# Altium project Cape.PrjPcb (part 2 of 3)

## Sheet psu.SchDoc: Power Supplies
size A2; DrawnBy: Stefan Lippuner; Organization: TIK; DocumentNumber: 3; Revision: 1; SheetNumber: 3; SheetTotal: 8
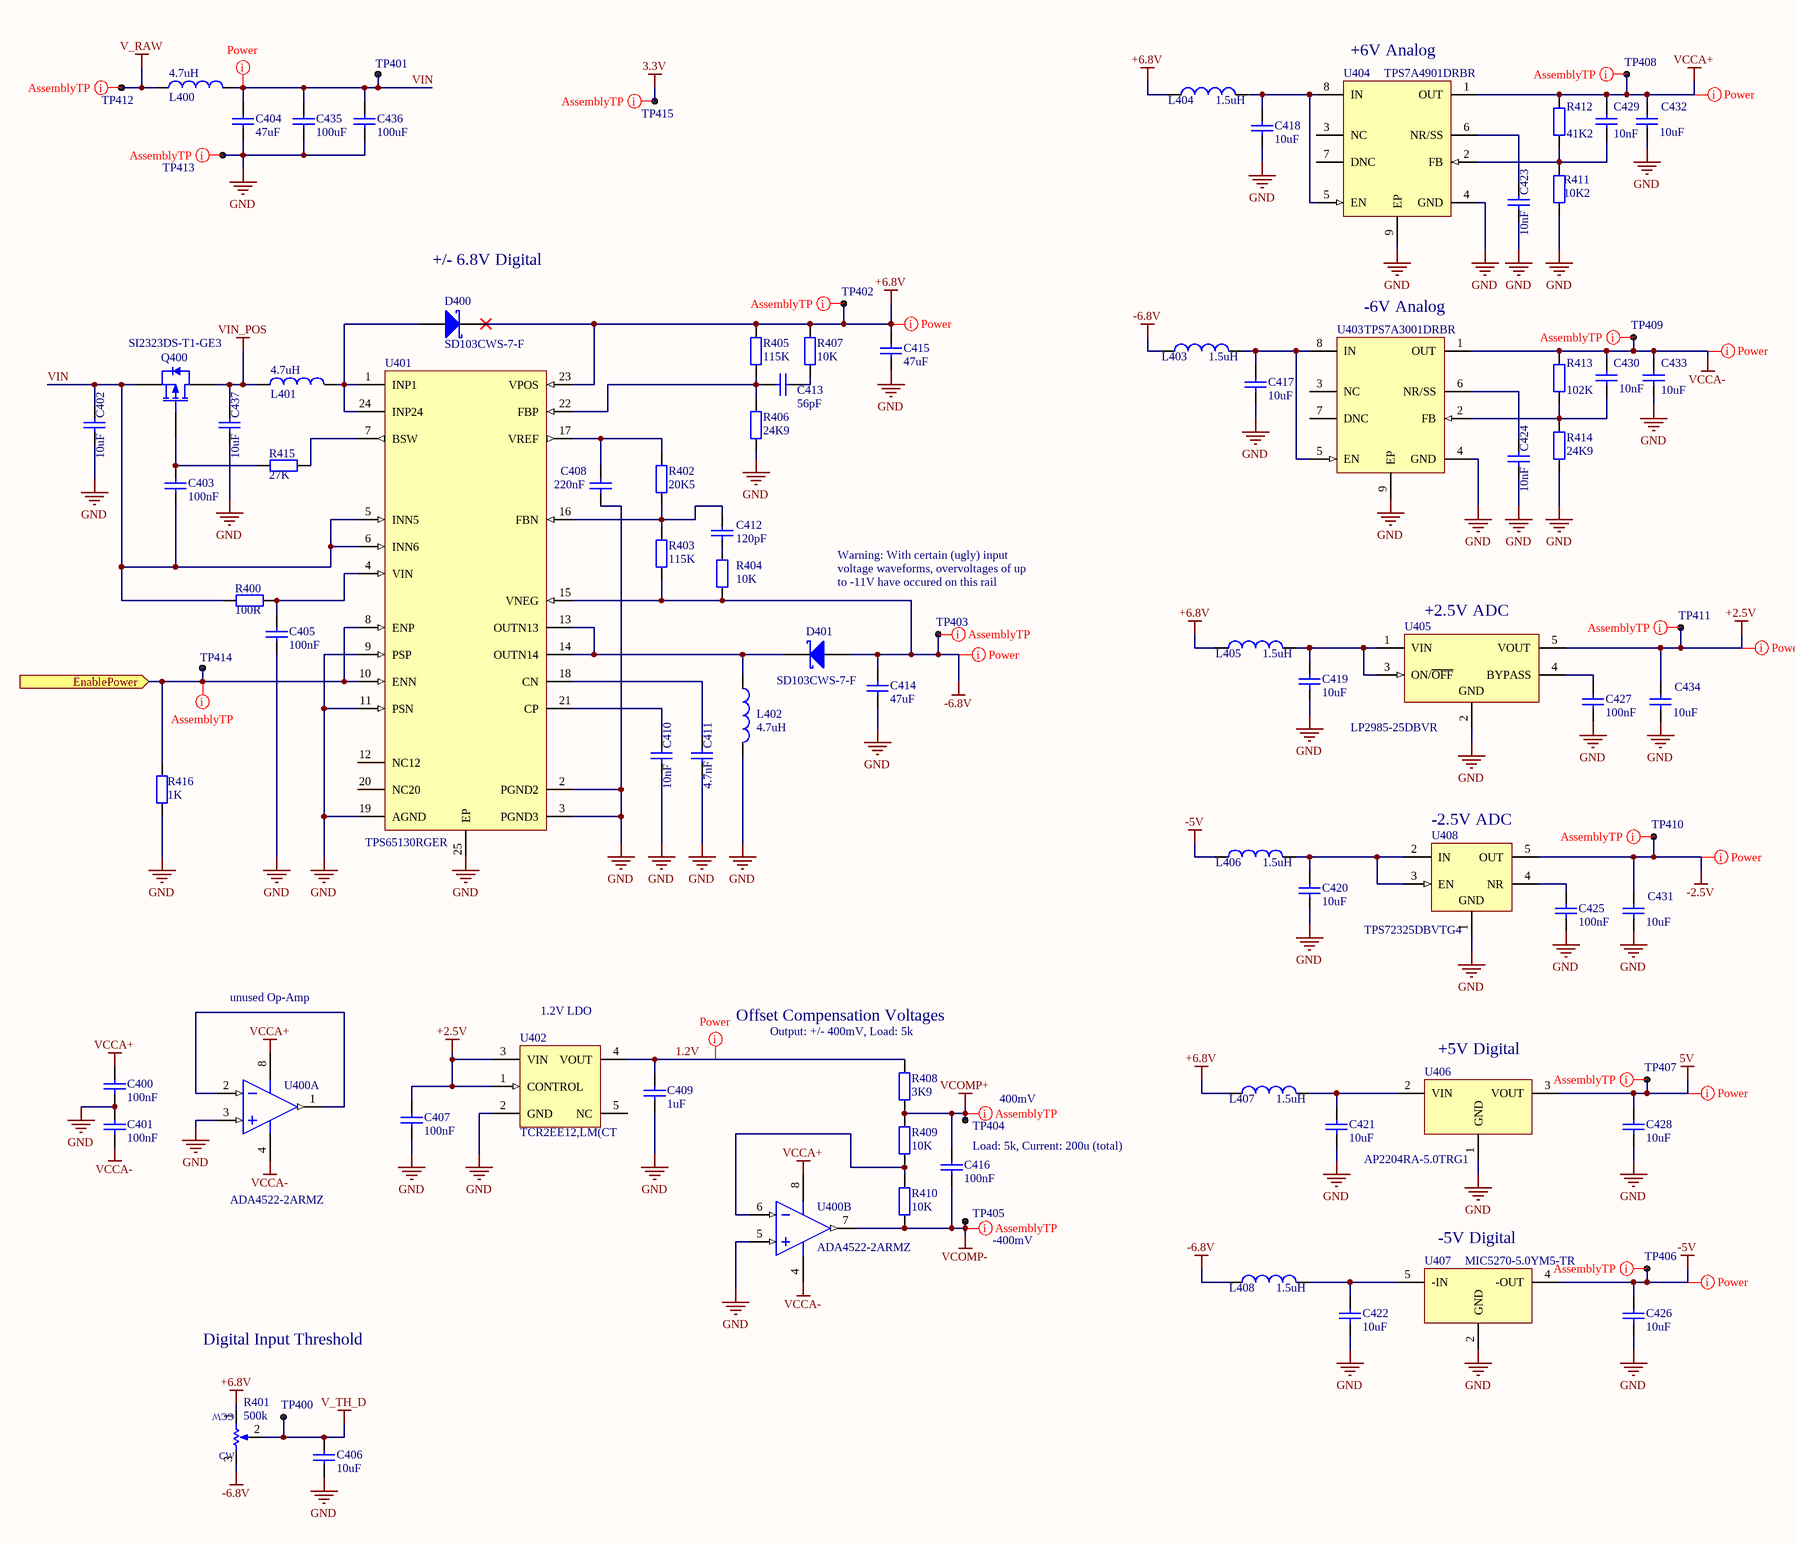
[diagram p3: psu.SchDoc]

### Parts
C400  100nF  [CAPC0402(1005)60_L]
C401  100nF  [CAPC0402(1005)60_L]
C402  10uF  [CAPC0603(1608)100_L]
C403  100nF  [CAPC0402(1005)60_L]
C404  47uF  [CAPC1210(3225)280_L]
C405  100nF  [CAPC0402(1005)60_L]
C406  10uF  [CAPC0603(1608)100_L]
C407  100nF  [CAPC0402(1005)60_L]
C408  220nF  [CAPC0402(1005)60_L]
C409  1uF  [CAPC0402(1005)60_L]
C410  10nF  [CAPC0402(1005)60_L]
C411  4.7nF  [CAPC0402(1005)60_L]
C412  120pF  [CAPC0402(1005)60_L]
C413  56pF  [CAPC0402(1005)60_L]
C414  47uF  [CAPC1210(3225)280_L]
C415  47uF  [CAPC1210(3225)280_L]
C416  100nF  [CAPC0402(1005)60_L]
C417  10uF  [CAPC0603(1608)100_L]
C418  10uF  [CAPC0603(1608)100_L]
C419  10uF  [CAPC0603(1608)100_L]
C420  10uF  [CAPC0603(1608)100_L]
C421  10uF  [CAPC0603(1608)100_L]
C422  10uF  [CAPC0603(1608)100_L]
C423  10nF  [CAPC0402(1005)60_L]
C424  10nF  [CAPC0402(1005)60_L]
C425  100nF  [CAPC0402(1005)60_L]
C426  10uF  [CAPC0603(1608)100_L]
C427  100nF  [CAPC0402(1005)60_L]
C428  10uF  [CAPC0603(1608)100_L]
C429  10nF  [CAPC0402(1005)60_L]
C430  10nF  [CAPC0402(1005)60_L]
C431  10uF  [CAPC0603(1608)100_L]
C432  10uF  [CAPC0603(1608)100_L]
C433  10uF  [CAPC0603(1608)100_L]
C434  10uF  [CAPC0603(1608)100_L]
C435  100uF  [CAPC1210(3225)200_L]
C436  100uF  [CAPC1210(3225)200_L]
C437  10uF  [CAPC0603(1608)100_L]
D400  SD103CWS-7-F  [DIOD-SOD323-2_V]
D401  SD103CWS-7-F  [DIOD-SOD323-2_V]
L400  4.7uH  [INDC2520X10L]
L401  4.7uH  [INDC2520X10L]
L402  4.7uH  [INDC2520X10L]
L403  1.5uH  [INDC0603(1608)_L]
L404  1.5uH  [INDC0603(1608)_L]
L405  1.5uH  [INDC0603(1608)_L]
L406  1.5uH  [INDC0603(1608)_L]
L407  1.5uH  [INDC0603(1608)_L]
L408  1.5uH  [INDC0603(1608)_L]
Q400  SI2323DS-T1-GE3  [SOT-23-TT3_N]
R400  100R  [RESC0402(1005)_L]
R401  value 500k  [43W]  (hidden comment: 43WR500KLFTR)
R402  20K5  [RESC0402(1005)_L]
R403  115K  [RESC0402(1005)_L]
R404  10K  [RESC0402(1005)_L]
R405  115K  [RESC0402(1005)_L]
R406  24K9  [RESC0402(1005)_L]
R407  10K  [RESC0402(1005)_L]
R408  3K9  [RESC0402(1005)_L]
R409  10K  [RESC0402(1005)_L]
R410  10K  [RESC0402(1005)_L]
R411  10K2  [RESC0402(1005)_L]
R412  41K2  [RESC0402(1005)_L]
R413  102K  [RESC0402(1005)_L]
R414  24K9  [RESC0402(1005)_L]
R415  27K  [RESC0402(1005)_L]
R416  1K  [RESC0402(1005)_L]
TP400  (no value)  [Pad-0.6mm]  (no BOM)
TP401  (no value)  [Pad-0.6mm]  (no BOM)
TP402  (no value)  [Pad-0.6mm]  (no BOM)
TP403  (no value)  [Pad-0.6mm]  (no BOM)
TP404  (no value)  [Pad-0.6mm]  (no BOM)
TP405  (no value)  [Pad-0.6mm]  (no BOM)
TP406  (no value)  [Pad-0.6mm]  (no BOM)
TP407  (no value)  [Pad-0.6mm]  (no BOM)
TP408  (no value)  [Pad-0.6mm]  (no BOM)
TP409  (no value)  [Pad-0.6mm]  (no BOM)
TP410  (no value)  [Pad-0.6mm]  (no BOM)
TP411  (no value)  [Pad-0.6mm]  (no BOM)
TP412  (no value)  [Pad-0.6mm]  (no BOM)
TP413  (no value)  [Pad-0.6mm]  (no BOM)
TP414  (no value)  [Pad-0.6mm]  (no BOM)
TP415  (no value)  [Pad-0.6mm]  (no BOM)
U400  ADA4522-2ARMZ  [ADI-RM-8_L]  (parts A,B of 2)
U401  TPS65130RGER  [LT-UF-24_L]
U402  TCR2EE12,LM(CT  [TI-DRL5_L]
U403  TPS7A3001DRBR  [DRB8-1750X1500TP]
U404  TPS7A4901DRBR  [DRB8-1750X1500TP]
U405  LP2985-25DBVR  [DBV0005A_L]
U406  AP2204RA-5.0TRG1  [SOT89_L]
U407  MIC5270-5.0YM5-TR  [Z5+1_L]
U408  TPS72325DBVTG4  [TI-DBV5_L]

### Ports
EnablePower (in)

### Nets
3.3V: TP415.1
5V: C428.2 TP407.1 U406.3(VOUT)
+2.5V: C407.2 C434.2 TP411.1 U402.1(CONTROL) U402.3(VIN) U405.5(VOUT)
+6.8V: C415.1 D400.2(K) L404.1 L405.1 L407.1 R401.1(CCW) R405.2 R407.2 TP402.1 U401.23(VPOS)
-2.5V: C431.2 TP410.1 U408.5(OUT)
-5V: C426.2 L406.1 TP406.1 U407.4(-OUT)
-6.8V: C414.1 D401.1(A) L403.1 L408.1 R401.3(CW) R403.2 R404.1 TP403.1 U401.15(VNEG)
GND: C400.1 C401.2 C402.1 C404.2 C405.1 C406.1 C407.1 C408.1 C409.1 C410.1 C411.1 C414.2 C415.2 C417.1 C418.1 C419.1 C420.1 C421.1 C422.1 C423.1 C424.1 C425.1 C426.1 C427.1 C428.1 C431.1 C432.1 C433.1 C434.1 C435.1 C436.1 C437.1 L402.2 R406.1 R411.1 R414.1 R416.1 TP413.1 U400.3(1IN+) U400.5(2IN+) U401.2(PGND2) U401.3(PGND3) U401.9(PSP) U401.11(PSN) U401.19(AGND) U401.25(EP) U402.2(GND) U403.4(GND) U403.9(EP) U404.4(GND) U404.9(EP) U405.2(GND) U406.1(GND) U407.2(GND) U408.1(GND)
V_RAW: L400.1 TP412.1
V_TH_D: C406.2 R401.2(WIPER) TP400.1
VCCA+: C400.2 C429.2 C432.2 R412.2 TP408.1 U400.8(V+) U404.1(OUT)
VCCA-: C401.1 C430.2 C433.2 R413.2 TP409.1 U400.4(V-) U403.1(OUT)
VCOMP+: C416.2 R408.1 R409.2 TP404.1
VCOMP-: C416.1 R410.1 TP405.1 U400.7(2OUT)
VIN_POS: C437.2 L401.1 Q400.3(D)
1.2V: C409.2 R408.2 U402.4(VOUT)
EnablePower: R416.2 TP414.1 U401.8(ENP) U401.10(ENN) ; port EnablePower
VIN: C402.2 C403.1 C404.1 C435.2 C436.2 L400.2 Q400.2(S) R400.2 TP401.1 U401.5(INN5) U401.6(INN6)
NetC403_2: C403.2 Q400.1(G) R415.1
NetC405_2: C405.2 R400.1 U401.4(VIN)
NetC408_2: C408.2 R402.2 U401.17(VREF)
NetC410_2: C410.2 U401.21(CP)
NetC411_2: C411.2 U401.18(CN)
NetC412_1: C412.1 R404.2
NetC412_2: C412.2 R402.1 R403.1 U401.16(FBN)
NetC413_1: C413.1 R407.1
NetC413_2: C413.2 R405.1 R406.2 U401.22(FBP)
NetC417_2: C417.2 L403.2 U403.5(EN) U403.8(IN)
NetC418_2: C418.2 L404.2 U404.5(EN) U404.8(IN)
NetC419_2: C419.2 L405.2 U405.1(VIN) U405.3(ON/~{OFF})
NetC420_2: C420.2 L406.2 U408.2(IN) U408.3(EN)
NetC421_2: C421.2 L407.2 U406.2(VIN)
NetC422_2: C422.2 L408.2 U407.5(-IN)
NetC423_2: C423.2 U404.6(NR/SS)
NetC424_2: C424.2 U403.6(NR/SS)
NetC425_2: C425.2 U408.4(NR)
NetC427_2: C427.2 U405.4(BYPASS)
NetC429_1: C429.1 R411.2 R412.1 U404.2(FB)
NetC430_1: C430.1 R413.1 R414.2 U403.2(FB)
NetD400_1: D400.1(A) L401.2 U401.1(INP1) U401.24(INP24)
NetD401_2: D401.2(K) L402.1 U401.13(OUTN13) U401.14(OUTN14)
NetR409_1: R409.1 R410.2 U400.6(2IN-)
NetR415_2: R415.2 U401.7(BSW)
NetU400_1: U400.1(1OUT) U400.2(1IN-)

Not connected (* = marked no-connect by the designer): U401 12(NC12) 20(NC20); U402 5(NC); U403 3(NC) 7(DNC); U404 3(NC) 7(DNC)

### Layout directives
net class Power: 1.2V, 5V, +2.5V, +6.8V, -2.5V, -5V, -6.8V, VCCA+, VCCA-, VIN
net class AssemblyTP: 3.3V, 5V, +2.5V, +6.8V, -2.5V, -5V, -6.8V, EnablePower, GND, V_RAW, VCCA+, VCCA-, VCOMP+, VCOMP-

### Notes on the sheet
- (near U404) +6V Analog
- +/- 6.8V Digital
- (near U403) -6V Analog
- Warning: With certain (ugly) input voltage waveforms, overvoltages of up to -11V have occured on this rail
- (near U405) +2.5V ADC
- (near U408) -2.5V ADC
- unused Op-Amp
- (near U402) 1.2V LDO
- (near R408) Offset Compensation Voltages
- (near R408) Output: +/- 400mV, Load: 5k
- (near TP404) 400mV
- (near U406) +5V Digital
- Load: 5k, Current: 200u (total)
- (near TP405) -400mV
- (near U407) -5V Digital
- Digital Input Threshold
- 1
- 2
- 3
- 4
- 5
- 6
- 7
- 8
- A
- B
- C
- D
- Project:
- Drawing number:
- Rev:
- Format:
- Laboratory:
- Sheet:
- File:
- Date:
- A2
- Drawn by:
- Page
- of

### Library data of the parts
C400 C401 C403 C405 C407 C416 C425 C427 = CMP-1034-02071-1: as C300 on sheet current_channel; Value: 100nF; Rated Voltage: 16 V; Tolerance: -20% to +80%; Technology: SMT; Max Thickness: 0.6 mm
C402 C406 C417-C422 C426 C428 C431-C434 C437 = CMP-1035-02800-1: CAP 10uF 10V ±20% 0603 (1608 Metric) Thickness 1mm SMD; Tolerance: Â±20%; Case-EIA: 0603; Case-Metric: 1608; Max Thickness: 1 mm; Rated Voltage: 10 V; Technology: SMT; Value: 10uF
C404 C414 C415 = CMP-1038-02296-1: CAP 47uF 16V ±20% 1210 (3225 Metric) Thickness 2.8mm SMD; Case-EIA: 1210; Case-Metric: 3225; Tolerance: Â±20%; Value: 47uF; Technology: SMT; Max Thickness: 2.8 mm; Rated Voltage: 16 V
C408 = CMP-1034-02088-1: CAP 220nF 10V -20% to +80% 0402 (1005 Metric) Thickness 0.6mm SMD; Case-Metric: 1005; Case-EIA: 0402; Value: 220nF; Rated Voltage: 10 V; Technology: SMT; Max Thickness: 0.6 mm; Tolerance: -20% to +80%
C409 = CMP-1034-02120-1: CAP 1uF 16V ±20% 0402 (1005 Metric) Thickness 0.6mm SMD; Tolerance: Â±20%; Case-EIA: 0402; Case-Metric: 1005; Rated Voltage: 16 V; Value: 1uF; Technology: SMT; Max Thickness: 0.6 mm
C410 = CMP-1034-01879-1: CAP 10nF 25V ±5% 0402 (1005 Metric) Thickness 0.6mm SMD; Case-EIA: 0402; Tolerance: Â±5%; Case-Metric: 1005; Value: 10nF; Max Thickness: 0.6 mm; Rated Voltage: 25 V; Technology: SMT
C411 = CMP-1034-01817-1: CAP 4.7nF 50V ±20% 0402 (1005 Metric) Thickness 0.6mm SMD; Tolerance: Â±20%; Case-Metric: 1005; Case-EIA: 0402; Max Thickness: 0.6 mm; Rated Voltage: 50 V; Value: 4.7nF; Technology: SMT
C412 = CMP-1034-01275-1: CAP 120pF 50V ±5% 0402 (1005 Metric) Thickness 0.6mm SMD; Case-EIA: 0402; Tolerance: Â±5%; Case-Metric: 1005; Technology: SMT; Value: 120pF; Max Thickness: 0.6 mm; Rated Voltage: 50 V
C413 = CMP-1034-01132-1: CAP 56pF 50V ±5% 0402 (1005 Metric) Thickness 0.6mm SMD; Tolerance: Â±5%; Case-Metric: 1005; Case-EIA: 0402; Rated Voltage: 50 V; Max Thickness: 0.6 mm; Technology: SMT; Value: 56pF
C423 C424 C429 C430 = CMP-1034-01879-1: CAP 10nF 25V ±5% 0402 (1005 Metric) Thickness 0.6mm SMD; Case-EIA: 0402; Case-Metric: 1005; Tolerance: Â±5%; Max Thickness: 0.6 mm; Value: 10nF; Technology: SMT; Rated Voltage: 25 V
C435 C436 = CMP-1590-00002-1: CAP 100uF 16V ±20% 1210 (3225 Metric) SMD; Case-EIA: 1210; Case-Metric: 3225; PackageReference: CAPC1210(3225)200; Supplier 1: Digi-Key; Supplier Part Number 1: 490-9969-6-ND
D400 D401 = CMP-00120-1: DIODE SCHOTTKY 20V 350MA SOD323; Manufacturer: Diodes Incorporated; Current - Average Rectified (Io): 350mA (DC); Voltage - Forward (Vf) (Max) @ If: 600mV @ 200mA; Speed: Fast Recovery =< 500ns, > 200mA (Io); Reverse Recovery Time (trr): 10ns; Current - Reverse Leakage @ Vr: 5µA @ 10V; Capacitance @ Vr, F: 28pF @ 0V, 1MHz; Packaging: Tape & Reel (TR); Diode Type: Schottky; Voltage - DC Reverse (Vr) (Max): 20V; Mounting Type: Surface Mount; Package / Case: SC-76, SOD-323; Supplier Device Package: SOD-323; Operating Temperature - Junction: -65°C ~ 125°C; P/N: SD103CWS-7-F; Supplier: Digi-Key; Supplier Part Number: SD103CWS-FDITR-ND; ComponentLink1Description: ds30101.pdf; ComponentLink1URL: http://www.diodes.com/_files/datasheets/ds30101.pdf
L400-L402 = CMP-00119-1: FIXED IND 4.7UH 1A 110 MOHM SMD; Manufacturer: TDK Corporation; Type: Multilayer; Material - Core: Ferrite; Inductance: 4.7µH; Tolerance: ±20%; Shielding: Shielded; DC Resistance (DCR): 143 mOhm Max; Frequency - Test: 2MHz; P/N: MLP2520S4R7ST0S1; Packaging: Tape & Reel (TR); Current Rating: 1A; Current - Saturation: -; Q @ Freq: -; Frequency - Self Resonant: -; Ratings: -; Operating Temperature: -40°C ~ 125°C; Mounting Type: Surface Mount; Package / Case: 1008 (2520 Metric); Size / Dimension: 0.098" L x 0.079" W (2.50mm x 2.00mm); Height - Seated (Max): 0.039" (1.00mm); Supplier: Digi-Key; Supplier Part Number: 445-6378-2-ND; ComponentLink1Description: inductor_commercial_power_mlp2520_en.pdf; ComponentLink1URL: https://product.tdk.com/info/en/catalog/datasheets/inductor_commercial_power_mlp2520_en.pdf
L403-L408 = CMP-00229-1: FIXED IND 1.5UH 50MA 700 MOHM; Manufacturer: TDK Corporation; Manufacturer Part Number: MLF1608A1R5M; Type: Multilayer; Material - Core: Ferrite; Inductance: 1.5µH; Tolerance: ±20%; Shielding: Shielded; DC Resistance (DCR): 700 mOhm Max; Q @ Freq: 35 @ 10MHz; Frequency - Self Resonant: 100MHz; Frequency - Test: 10MHz; Packaging: Cut Tape (CT); Part Status: Active; Current Rating: 50mA; Current - Saturation: -; Ratings: -; Operating Temperature: -40°C ~ 85°C; Mounting Type: Surface Mount; Package / Case: 0603 (1608 Metric); Size / Dimension: 0.063" L x 0.031" W (1.60mm x 0.80mm); Height - Seated (Max): 0.037" (0.95mm); Supplier: Digi-Key; Supplier Part Number: 445-6221-1-ND; ComponentLink1Description: inductor_commercial_standard_mlf1608_en.pdf; ComponentLink1URL: https://product.tdk.com/info/en/catalog/datasheets/inductor_commercial_standard_mlf1608_en.pdf
Q400 = CMP-00292-1: MOSFET P-CH 20V 3.7A SOT23-3; Manufacturer: Vishay Siliconix; FET Type: MOSFET P-Channel, Metal Oxide; FET Feature: Standard; Current - Continuous Drain (Id) @ 25°C: 3.7A (Ta); Rds On (Max) @ Id, Vgs: 39 mOhm @ 4.7A, 4.5V; Vgs(th) (Max) @ Id: 1V @ 250µA; Gate Charge (Qg) @ Vgs: 19nC @ 4.5V; Input Capacitance (Ciss) @ Vds: 1020pF @ 10V; Power - Max: 750mW; Packaging: Cut Tape (CT); Part Status: Active; Drain to Source Voltage (Vdss): 20V; Operating Temperature: -55°C ~ 150°C (TJ); Mounting Type: Surface Mount; Package / Case: TO-236-3, SC-59, SOT-23-3; Supplier Device Package: SOT-23-3 (TO-236); Manufacturer Part Number: SI2323DS-T1-GE3; Supplier: Digi-Key; Supplier Part Number: SI2323DS-T1-GE3CT-ND; ComponentLink1Description: 72024.pdf; ComponentLink1URL: http://www.vishay.com/docs/72024/72024.pdf
R400 = CMP-1011-00397-1: 100R 0.063W 1% 0402 (1005 Metric)  SMD; Case-EIA: 0402; Case-Metric: 1005; Value: 100.00 Ohm; Technology: SMT; Tolerance: 1 %; Power: 0.063 W
R401 = CMP-00227-2: TRIMMER 500K OHM 0.125W SMD; Manufacturer: TT Electronics/BI; Power (Watts): 0.125W, 1/8W; Tolerance: ±20%; Temperature Coefficient: ±100ppm/°C; Number of Turns: 11; Adjustment Type: Top Adjustment; Resistive Material: Cermet; Packaging: Digi-Reel®; Part Status: Active; Resistance (Ohms): 500k; Mounting Type: Surface Mount; Termination Style: J Lead; Size / Dimension: Rectangular - 0.161" x 0.125" Face x 0.161" H (4.10mm x 3.18mm x 4.10mm); Manufacturer Part Number: 43WR500KLFTR; Supplier: Digi-Key; Supplier Part Number: 987-1040-6-ND; ComponentLink1Description: 43.pdf; ComponentLink1URL: http://www.bitechnologies.com/pdfs/43.pdf
R402 = CMP-1011-00656-1: 20K5 0.063W 1% 0402 (1005 Metric)  SMD; Case-Metric: 1005; Value: 20500.00 Ohm; Case-EIA: 0402; Power: 0.063 W; Technology: SMT; Tolerance: 1 %
R403 R405 = CMP-1011-00742-1: 115K 0.063W 1% 0402 (1005 Metric)  SMD; Case-Metric: 1005; Value: 115000.00 Ohm; Case-EIA: 0402; Tolerance: 1 %; Technology: SMT; Power: 0.063 W
R404 R407 R409 R410 = CMP-1011-00623-1: as R303 on sheet current_channel; Tolerance: 1 %; Technology: SMT; Power: 0.063 W
R406 R414 = CMP-1011-00666-1: 24K9 0.063W 1% 0402 (1005 Metric)  SMD; Value: 24900.00 Ohm; Case-Metric: 1005; Case-EIA: 0402; Tolerance: 1 %; Technology: SMT; Power: 0.063 W
R408 = CMP-1011-00576-1: 3K9 0.063W 1% 0402 (1005 Metric)  SMD; Case-EIA: 0402; Value: 3900.00 Ohm; Case-Metric: 1005; Tolerance: 1 %; Power: 0.063 W; Technology: SMT
R411 = CMP-1011-00624-1: 10K2 0.063W 1% 0402 (1005 Metric)  SMD; Value: 10200.00 Ohm; Case-EIA: 0402; Case-Metric: 1005; Technology: SMT; Power: 0.063 W; Tolerance: 1 %
R412 = CMP-1011-00692-1: 41K2 0.063W 1% 0402 (1005 Metric)  SMD; Value: 41200.00 Ohm; Case-Metric: 1005; Case-EIA: 0402; Technology: SMT; Tolerance: 1 %; Power: 0.063 W
R413 = CMP-1011-00737-1: 102K 0.063W 1% 0402 (1005 Metric)  SMD; Value: 102000.00 Ohm; Case-Metric: 1005; Case-EIA: 0402; Technology: SMT; Tolerance: 1 %; Power: 0.063 W
R415 = CMP-1011-00670-1: 27K 0.063W 1% 0402 (1005 Metric)  SMD; Case-EIA: 0402; Value: 27000.00 Ohm; Case-Metric: 1005; Technology: SMT; Tolerance: 1 %; Power: 0.063 W
R416 = CMP-1011-00510-1: as R314 on sheet current_channel; Technology: SMT; Tolerance: 1 %; Power: 0.063 W
TP400-TP415 = CMP-00224-1: 0.6mm SMT Test Pad; Mounting Technology: SMT
U400 = CMP-00103-1: SP Amp Zero Drift Amplifier Dual R-R I/O ±27.5V/55V 8-Pin MSOP; Manufacturer: Analog Devices Inc.; Amplifier Type: Zero-Drift; Output Type: Rail-to-Rail; Slew Rate: 1.7 V/µs; Gain Bandwidth Product: 2.7MHz; Current - Input Bias: 50pA; Voltage - Input Offset: 1.5µV; Current - Supply: 830µA; Current - Output / Channel: 32mA; Voltage - Supply, Single/Dual (±): 4.5 V ~ 55 V, ±2.25 V ~ 27.5 V; Packaging: Tube; Number of Circuits: -; -3db Bandwidth: -; Operating Temperature: -40°C ~ 125°C; Mounting Type: Surface Mount; Package / Case: 8-TSSOP, 8-MSOP (0.118", 3.00mm Width); Supplier Device Package: 8-MSOP; Manufacturer Part Number: ADA4522-2ARMZ; Supplier: Digi-Key; Supplier Part Number: ADA4522-2ARMZ-ND; ComponentLink1Description: ADA4522-1_4522-2_4522-4.pdf; ComponentLink1URL: http://www.analog.com/media/en/technical-documentation/data-sheets/ADA4522-1_4522-2_4522-4.pdf
U401 = CMP-00108-2: Conv DC-DC Dual Inv/Step Up 2.7V to 5.5V 24-Pin VQFN EP; Manufacturer: Texas Instruments; Function: Step-Up, Step-Up/Step-Down; Output Configuration: Positive and Negative (Dual Rail); Topology: Boost, Buck-Boost; Output Type: Adjustable; Number of Outputs: 2; Voltage - Output (Min/Fixed): 3.2V, -2V; Voltage - Output (Max): 15V, -15V; Current - Output: 700mA (Switch); Frequency - Switching: 1.38MHz; Synchronous Rectifier: No; Packaging: Cut Tape (CT); Voltage - Input (Min): 2.7V; Voltage - Input (Max): 5.5V; Operating Temperature: -40°C ~ 85°C (TA); Mounting Type: Surface Mount; Package / Case: 24-VFQFN Exposed Pad; Supplier Device Package: 24-VQFN (4x4); P/N: TPS65130RGER; Supplier: Digi-Key; Supplier Part Number: 296-17080-1-ND; ComponentLink1Description: tps65130.pdf; ComponentLink1URL: http://www.ti.com/lit/ds/symlink/tps65130.pdf
U402 = CMP-00117-2: IC REG LDO 1.2V 0.2A ESV; Manufacturer: Toshiba Semiconductor and Storage; Regulator Topology: Positive Fixed; Current - Output: 200mA; Voltage - Dropout (Typical): 0.38V @ 150mA; Number of Regulators: 1; Voltage - Input: Up to 5.5V; Packaging: Tape & Reel (TR); Voltage - Output: 1.2V; Current - Limit (Min): -; Operating Temperature: -40°C ~ 85°C; Mounting Type: Surface Mount; Package / Case: SOT-553; Supplier Device Package: ESV; P/N: TCR2EE12,LM(CT; Supplier: Digi-Key; Supplier Part Number: TCR2EE12LM(CTTR-ND; ComponentLink1Description: docget.jsp?pid=TCR2EE10&lang=en&type=datasheet; ComponentLink1URL: http://www.semicon.toshiba.co.jp/info/docget.jsp?pid=TCR2EE10&lang=en&type=datasheet
U403 = CMP-00109-1: LDO Voltage Regulators Vin -3V to -36V, -200mA, Ultra-Low Noise, High PSRR, Low-Dropout Linear Regulator 8-SON; Manufacturer: Texas Instruments; Regulator Topology: Negative Adjustable; Voltage - Output: -1.18 V ~ -33 V; Current - Output: 200mA; Voltage - Dropout (Typical): 0.325V @ 200mA; Number of Regulators: 1; Voltage - Input: -3 V ~ -35 V; Current - Limit (Min): 220mA; Packaging: Tape & Reel (TR); Operating Temperature: -40°C ~ 125°C; Mounting Type: Surface Mount; Package / Case: 8-VFDFN Exposed Pad; Supplier Device Package: 8-SON (3x3); P/N: TPS7A3001DRBR; Supplier: Digi-Key; Supplier Part Number: 296-42394-2-ND; ComponentLink1Description: tps7a30.pdf; ComponentLink1URL: http://www.ti.com/lit/ds/symlink/tps7a30.pdf
U404 = CMP-00110-1: LDO Voltage Regulators Vin 3V to 36V, 150mA, Ultra-Low Noise, High PSRR, Low-Dropout Linear Regulator 8-SON; Manufacturer: Texas Instruments; Regulator Topology: Positive Adjustable; Voltage - Output: 1.194 V ~ 33 V; Voltage - Dropout (Typical): 0.333V @ 150mA; Number of Regulators: 1; Voltage - Input: 3 V ~ 35 V; Current - Limit (Min): 220mA; ComponentLink1Description: tps7a49.pdf; ComponentLink1URL: http://www.ti.com/lit/ds/symlink/tps7a49.pdf; Packaging: Cut Tape (CT); Current - Output: 150mA; Operating Temperature: -40°C ~ 125°C; Mounting Type: Surface Mount; Package / Case: 8-VDFN Exposed Pad; Supplier Device Package: 8-SON (3x3); P/N: TPS7A4901DRBR; Supplier: Digi-Key; Supplier Part Number: 296-42154-1-ND
U405 = CMP-0758-00027-2: Single Output Low Noise LDO, 150 mA, Fixed 2.5 V Output, 1.5% Tolerance, 2.2 to 16 V Input, Low IQ, 5-Pin SOT-23 (DBV), -40 to 125 degC, Green (RoHS & no Sb/Br), Tape and Reel; Manufacturer: Texas Instruments; Fixed Output Options (V): 2.5; Accuracy (%): 1.5; Vdo (Typ) (mV): 280; Iout (Max) (A): 0.15; Output Options: Fixed Output; Iq (Typ) (mA): 0.85; ComponentLink3Description: Package Specification; RoHS: TRUE; DatasheetVersion: SLVS522N; ComponentLink1Description: Manufacturer URL; Operating Temperature Range (degC): -40 to 125; Packing: Tape and Reel; PackageReference: DBV0005A; ComponentLink3URL: http://www.ti.com/litv/pdf/mpds018j; ComponentLink2Description: Datasheet; Vin (V): 2.2 to 16; PackageVersion: 4073253-4/L; PackageDescription: 5-Pin Plastic Small Outline, Body 2.9 x 1.6 mm, Pitch 0.95 mm; ComponentLink1URL: http://www.ti.com/; ComponentLink2URL: http://www.ti.com/lit/ds/symlink/lp2985-50.pdf; PartNumber: LP2985-25DBVR; Mounting Technology: Surface Mount
U406 = CMP-00226-1: IC REG LDO Linear Voltage Regulator Positive Fixed 1 Output 5V 150mA SOT-89-3; Manufacturer: Diodes Incorporated; Voltage - Dropout (Typical): 0.36V @ 150mA; Number of Regulators: 1; Voltage - Input: Up to 24V; Packaging: Cut Tape (CT); Part Status: Active; Regulator Topology: Positive Fixed; Voltage - Output: 5V; Current - Output: 150mA; Current - Limit (Min): -; Operating Temperature: -40°C ~ 85°C; Mounting Type: Surface Mount; Package / Case: TO-243AA; Supplier Device Package: SOT-89-3; Manufacturer Part Number: AP2204RA-5.0TRG1; Supplier: Digi-Key; Supplier Part Number: AP2204RA-5.0TRG1DICT-ND; ComponentLink1Description: AP2204.pdf; ComponentLink1URL: http://www.diodes.com/_files/datasheets/AP2204.pdf
U407 = CMP-00219-1: IC REG LDO Linear Voltage Regulator Negative Fixed 1 Output -5V 100mA SOT-23-5; Manufacturer: Microchip Technology; Voltage - Dropout (Typical): 0.5V @ 100mA; Number of Regulators: 1; Voltage - Input: Down to -16V; Packaging: Cut Tape (CT); Part Status: Active; Regulator Topology: Negative Fixed; Voltage - Output: -5V; Current - Output: 100mA; Current - Limit (Min): -; Operating Temperature: -40°C ~ 125°C; Mounting Type: Surface Mount; Package / Case: SC-74A, SOT-753; Supplier Device Package: SOT-23-5; Manufacturer Part Number: MIC5270-5.0YM5-TR; Supplier: Digi-Key; Supplier Part Number: 576-1294-1-ND; ComponentLink1Description: filehandler.aspx?ddocname=en579863; ComponentLink1URL: http://www.microchip.com/mymicrochip/filehandler.aspx?ddocname=en579863
U408 = CMP-0394-00283-1: Single Output High PSRR LDO, 200 mA, Fixed -2.5 V Output, -10 to -2.7 V Input, 5-pin SOT-23 (DBV), -40 to 125 degC, Green (RoHS & no Sb/Br); Manufacturer: Texas Instruments; Vdo(Typ)(mV): 280; Accuracy(%): 2; SubFamily: Single Channel LDO; Iq(Typ)(mA): 0.13; Iout(Max)(A): 0.2; ComponentLink3Description: Package Specification; PartNumber: TPS72325DBVTG4; Mounting Technology: Surface Mount; Vout Adj(Max)(V): -2.5; DatasheetVersion: SLVS346B; Eco-Plan: Green (RoHS & no Sb/Br); Fixed Output Options(V): -2.5; ComponentLink2Description: Datasheet; ComponentLink1URL: http://www.ti.com/; PackageDescription: 5-Pin Plastic Small Outline, Body 1.60 Ãƒâ€” 2.90 mm, Pitch 0.95 mm; ComponentLink1Description: Manufacturer URL; ComponentLink2URL: http://www.ti.com/general/docs/lit/getliterature.tsp?genericPartNumber=TPS72325&fileType=pdf; Code_JEDEC: MO-178; Vin(Max)(V): -2.7; PackageVersion: 4073253-4/K; Vout Adj(Min)(V): -2.5; ComponentLink3URL: http://www.ti.com/litv/pdf/mpds018i; PackageReference: DBV5; Vin(Min)(V): -10

## Sheet cape.SchDoc: Cape
size A4; DrawnBy: Stefan Lippuner; Organization: TIK; DocumentNumber: 2; Revision: 2; SheetNumber: 2; SheetTotal: 8
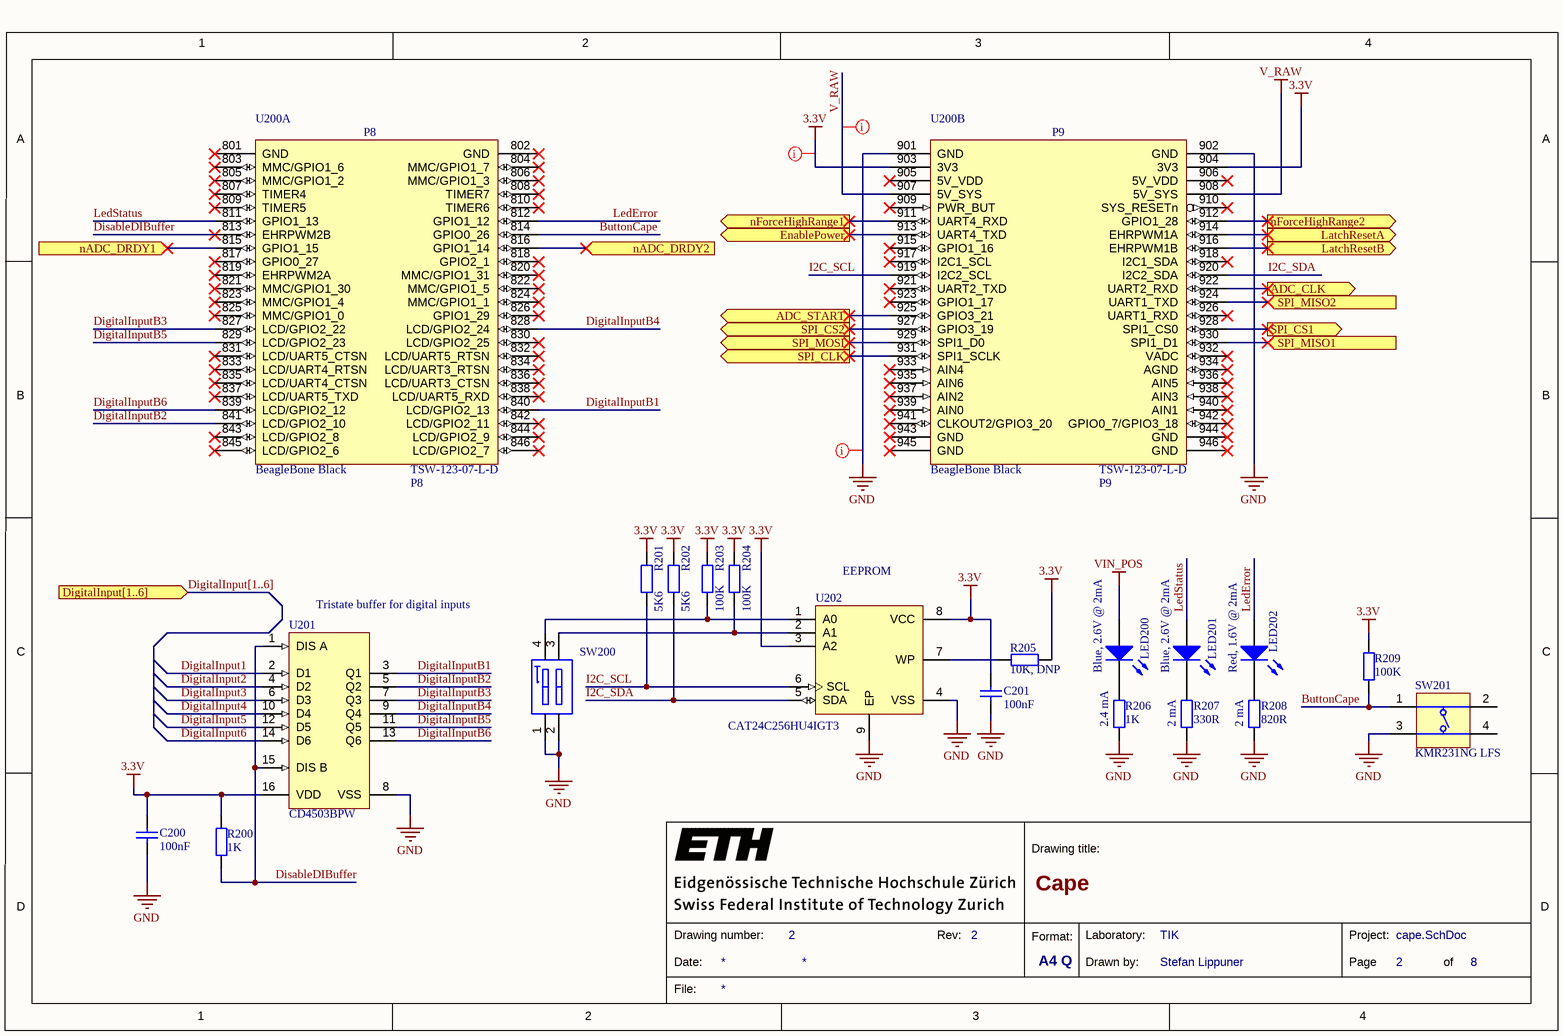
[diagram p4: cape.SchDoc]

### Parts
C200  100nF  [CAPC0402(1005)60_L]
C201  100nF  [CAPC0402(1005)60_L]
LED200  Blue, 2.6V @ 2mA  [0603_A]
LED201  Blue, 2.6V @ 2mA  [0603_A]
LED202  Red, 1.6V @ 2mA  [0603_A]
P8  TSW-123-07-L-D (BOM)  (value not drawn)  (mechanical)
P9  TSW-123-07-L-D (BOM)  (value not drawn)  (mechanical)
R200  1K  [RESC0402(1005)_L]
R201  5K6  [RESC0402(1005)_L]
R202  5K6  [RESC0402(1005)_L]
R203  100K  [RESC0402(1005)_L]
R204  100K  [RESC0402(1005)_L]
R205  10K, DNP  [RESC0402(1005)_L]  (no BOM)
R206  1K  [RESC0402(1005)_L]
R207  330R  [RESC0402(1005)_L]
R208  820R  [RESC0402(1005)_L]
R209  100K  [RESC0402(1005)_L]
SW200  218-2LPST  [416131160802]  (value not drawn)
SW201  KMR231NG LFS  [KRM 2 Series]
U200  BeagleBone Black  (parts A,B of 2)  (no BOM)
U201  CD4503BPW  [PW0016A_L]
U202  CAT24C256HU4IGT3  [UDFN-MU8]

### Ports
ADC_CLK (out), ADC_START (out), DigitalInput[1..6] (in), EnablePower (out), LatchResetA (out), LatchResetB (out), nADC_DRDY1 (in), nADC_DRDY2 (in), nForceHighRange1 (out), nForceHighRange2 (out), SPI_CLK (out), SPI_CS1 (out), SPI_CS2 (out), SPI_MISO1 (in), SPI_MISO2 (in), SPI_MOSI (out)

### Nets
3.3V: C200.2 C201.2 R200.2 R201.2 R202.2 R203.2 R204.2 R205.2 R209.2 U200.903(3V3) U200.904(3V3) U201.16(VDD) U202.3(A2) U202.8(VCC)
GND: C200.1 C201.1 R206.1 R207.1 R208.1 SW200.1 SW200.2 SW201.3(T3) U200.901(GND) U200.902(GND) U201.8(VSS) U202.4(VSS) U202.9(EP)
V_RAW: U200.907(5V_SYS) U200.908(5V_SYS)
VIN_POS: LED200.2(A)
ButtonCape: R209.1 SW201.1(T1) U200.814(GPIO0_26)
DigitalInput1: U201.2(D1)
DigitalInput2: U201.4(D2)
DigitalInput3: U201.6(D3)
DigitalInput4: U201.10(D4)
DigitalInput5: U201.12(D5)
DigitalInput6: U201.14(D6)
DigitalInputB1: U200.840(LCD/GPIO2_13) U201.3(Q1)
DigitalInputB2: U200.841(LCD/GPIO2_10) U201.5(Q2)
DigitalInputB3: U200.827(LCD/GPIO2_22) U201.7(Q3)
DigitalInputB4: U200.828(LCD/GPIO2_24) U201.9(Q4)
DigitalInputB5: U200.829(LCD/GPIO2_23) U201.11(Q5)
DigitalInputB6: U200.839(LCD/GPIO2_12) U201.13(Q6)
DisableDIBuffer: R200.1 U200.813(EHRPWM2B) U201.1(DIS_A) U201.15(DIS_B)
EnablePower: U200.913(UART4_TXD) ; port EnablePower
ForceHighRange1: U200.911(UART4_RXD) ; port nForceHighRange1
ForceHighRange2: U200.912(GPIO1_28) ; port nForceHighRange2
I2C_SCL: R201.1 U200.919(I2C2_SCL) U202.6(SCL)
I2C_SDA: R202.1 U200.920(I2C2_SDA) U202.5(SDA)
LedError: LED202.2(A) U200.812(GPIO1_12)
LedStatus: LED201.2(A) U200.811(GPIO1_13)
NetLED200_1: LED200.1(K) R206.2
NetLED201_1: LED201.1(K) R207.2
NetLED202_1: LED202.1(K) R208.2
NetR203_1: R203.1 SW200.4 U202.1(A0)
NetR204_1: R204.1 SW200.3 U202.2(A1)
NetR205_1: R205.1 U202.7(WP)
NetR704_1: U200.916(EHRPWM1B) ; port LatchResetB
NetR705_1: U200.914(EHRPWM1A) ; port LatchResetA
NetU100_1_34: U200.929(SPI1_D0) ; port SPI_MOSI
NetU100_1_37: U200.922(UART2_RXD) ; port ADC_CLK
NetU100_1_38: U200.925(GPIO3_21) ; port ADC_START
NetU100_1_39: U200.928(SPI1_CS0) ; port SPI_CS1
NetU100_1_40: U200.931(SPI1_SCLK) ; port SPI_CLK
NetU100_1_43: U200.930(SPI1_D1) ; port SPI_MISO1
NetU100_1_47: U200.815(GPIO1_15) ; port nADC_DRDY1
NetU100_2_39: U200.927(GPIO3_19) ; port SPI_CS2
NetU100_2_43: U200.924(UART1_TXD) ; port SPI_MISO2
NetU100_2_47: U200.816(GPIO1_14) ; port nADC_DRDY2

Not connected (* = marked no-connect by the designer): SW201 2(T2) 4(T3); U200 801(GND)* 802(GND)* 803(MMC/GPIO1_6)* 804(MMC/GPIO1_7)* 805(MMC/GPIO1_2)* 806(MMC/GPIO1_3)* 807(TIMER4)* 808(TIMER7)* 809(TIMER5)* 810(TIMER6)* 817(GPIO0_27)* 818(GPIO2_1)* 819(EHRPWM2A)* 820(MMC/GPIO1_31)* 821(MMC/GPIO1_30)* 822(MMC/GPIO1_5)* 823(MMC/GPIO1_4)* 824(MMC/GPIO1_1)* 825(MMC/GPIO1_0)* 826(GPIO1_29)* 830(LCD/GPIO2_25)* 831(LCD/UART5_CTSN)* 832(LCD/UART5_RTSN)* 833(LCD/UART4_RTSN)* 834(LCD/UART3_RTSN)* 835(LCD/UART4_CTSN)* 836(LCD/UART3_CTSN)* 837(LCD/UART5_TXD)* 838(LCD/UART5_RXD)* 842(LCD/GPIO2_11)* 843(LCD/GPIO2_8)* 844(LCD/GPIO2_9)* 845(LCD/GPIO2_6)* 846(LCD/GPIO2_7)* 905(5V_VDD)* 906(5V_VDD)* 909(PWR_BUT)* 910(SYS_RESETn)* 915(GPIO1_16)* 917(I2C1_SCL)* 918(I2C1_SDA)* 921(UART2_TXD)* 923(GPIO1_17)* 926(UART1_RXD)* 932(VADC)* 933(AIN4)* 934(AGND)* 935(AIN6)* 936(AIN5)* 937(AIN2)* 938(AIN3)* 939(AIN0)* 940(AIN1)* 941(CLKOUT2/GPIO3_20)* 942(GPIO0_7/GPIO3_18)* 943(GND)* 944(GND)* 945(GND)* 946(GND)*

### Buses and harness runs
bus DigitalInput[1..6] = port DigitalInput[1..6]

### Layout directives
net class Power: 3.3V, GND, V_RAW

### Notes on the sheet
- (near U202) EEPROM
- Tristate buffer for digital inputs
- (near R206) 2.4 mA
- (near R207) 2 mA
- (near R208) 2 mA
- 1
- 2
- 3
- 4
- A
- B
- C
- Drawing title:
- D
- Date:
- Drawing number:
- Rev:
- Format:
- A4 Q
- Drawn by:
- Laboratory:
- Page
- Project:
- of
- File:
- (in symbol CMP-00111-2, part A) P8
- (in symbol CMP-00111-2, part B) P9
- (in symbol TSW-123-07-L-D (BOM)) TSW-123-07-L-D

### Library data of the parts
C200 C201 = CMP-1034-02071-1: CAP 100nF 16V -20% to +80% 0402 (1005 Metric) Thickness 0.6mm SMD; Case-Metric: 1005; Case-EIA: 0402; Value: 100nF; Rated Voltage: 16 V; Tolerance: -20% to +80%; Technology: SMT; Max Thickness: 0.6 mm
LED200 LED201 = CMP-1426-00003-1: SMD mono-color Chip LED, WL-SMCW, Blue; PartNumber: 150060BS75000; Manufacturer: Wuerth Elektronik; Color: Blue; ComponentLink2Description: Datasheet; ComponentLink2URL: http://katalog.we-online.com/led/datasheet/150060BS75000.pdf; ComponentLink1URL: http://www.we-online.com; PackageReference: 0603_A; ComponentLink1Description: Manufacturer URL
LED202 = CMP-1426-00001-1: SMD mono-color Chip LED, WL-SMCW, Red; Manufacturer: Wuerth Elektronik; PartNumber: 150060RS75000; Color: Red; PackageReference: 0603_A; ComponentLink2URL: http://katalog.we-online.com/led/datasheet/150060RS75000.pdf; ComponentLink1URL: http://www.we-online.com; ComponentLink1Description: Manufacturer URL; ComponentLink2Description: Datasheet
P8 P9 = TSW-123-07-L-D (BOM): Conn Unshrouded Header HDR 46 POS 2.54mm Solder ST Thru-Hole; Supplier 1: Digi-Key; Supplier Part Number 1: SAM1030-23-ND
R200 = CMP-1011-00510-1: 1K 0.063W 1% 0402 (1005 Metric)  SMD; Case-EIA: 0402; Value: 1000.00 Ohm; Case-Metric: 1005; Technology: SMT; Tolerance: 1 %; Power: 0.063 W
R201 R202 = CMP-1011-00092-1: 5K6 0.063W 5% 0402 (1005 Metric)  SMD; Case-EIA: 0402; Case-Metric: 1005; Value: 5600.00 Ohm; Technology: SMT; Tolerance: 5 %; Power: 0.063 W
R203 R204 = CMP-1011-00736-1: 100K 0.063W 1% 0402 (1005 Metric)  SMD; Value: 100000.00 Ohm; Case-EIA: 0402; Case-Metric: 1005; Power: 0.063 W; Technology: SMT; Tolerance: 1 %
R205 = CMP-1011-00623-1: 10K 0.063W 1% 0402 (1005 Metric)  SMD; Case-Metric: 1005; Value: 10000.00 Ohm; Case-EIA: 0402; Tolerance: 1 %; Technology: SMT; Power: 0.063 W
R206 = CMP-1011-00510-1: 1K 0.063W 1% 0402 (1005 Metric)  SMD; Value: 1000.00 Ohm; Case-EIA: 0402; Case-Metric: 1005; Tolerance: 1 %; Power: 0.063 W; Technology: SMT
R207 = CMP-1011-00062-1: 330R 0.063W 5% 0402 (1005 Metric)  SMD; Case-EIA: 0402; Value: 330.00 Ohm; Case-Metric: 1005; Tolerance: 5 %; Technology: SMT; Power: 0.063 W
R208 = CMP-1011-00072-1: 820R 0.063W 5% 0402 (1005 Metric)  SMD; Value: 820.00 Ohm; Case-Metric: 1005; Case-EIA: 0402; Tolerance: 5 %; Technology: SMT; Power: 0.063 W
R209 = CMP-1011-00736-1: 100K 0.063W 1% 0402 (1005 Metric)  SMD; Case-Metric: 1005; Value: 100000.00 Ohm; Case-EIA: 0402; Tolerance: 1 %; Technology: SMT; Power: 0.063 W
SW200 = CMP-00125-1: Switch DIP ON OFF SPST 2 Recessed Slide 0.025A 24VDC Gull Wing 1.27mm SMD; Manufacturer: CTS Electrocomponents; Number of Positions: 2; Current Rating: 25mA; Actuator Type: Slide (Standard); Actuator Level: Flush, Recessed; Pitch: 0.050" (1.27mm), Half; Washable: Yes; Electrical Life: 1,000 Cycles; Packaging: Tube; Circuit: SPST; Voltage Rating: 24VDC; Contact Material: Beryllium Copper; Contact Finish: Gold; Height Above Board: 0.104" (2.65mm); Mounting Type: Surface Mount; Termination Style: Gull Wing; Features: Epoxy Sealed Terminals, Tape Seal; Body Material: -; Length: 0.146" (3.71mm); Operating Temperature: -55°C ~ 85°C; Mechanical Life: -; Manufacturer Part Number: 218-2LPST; Supplier: Digi-Key; Supplier Part Number: CT2182LPST-ND; ComponentLink1Description: 218.pdf; ComponentLink1URL: http://www.ctscorp.com/wp-content/uploads/2015/11/218.pdf
SW201 = CMP-00230-1: SWITCH TACTILE SPST-NO 0.05A 32V; Manufacturer: C&K Components; Switch Function: Off-Mom; Contact Rating @ Voltage: 0.05A @ 32VDC; Actuator Type: Standard; Actuator Height off PCB, from Pins: 1.90mm; Actuator Orientation: Top Actuated; Outline: 4.60mm x 2.80mm; Illumination: Non-Illuminated; Operating Force: 300gf; Switch Travel: 0.25mm; Mechanical Life: 150,000 Cycles; Packaging: Cut Tape (CT); Part Status: Active; Circuit: SPST-NO; Mounting Type: Surface Mount; Termination Style: Gull Wing; Illumination Voltage (Nominal): -; Illumination Type, Color: -; Ingress Protection: -; Features: -; Actuator Material: -; Operating Temperature: -40°C ~ 85°C; Manufacturer Part Number: KMR231NG LFS; Supplier: Digi-Key; Supplier Part Number: CKN10246CT-ND; ComponentLink1Description: kmr2.pdf; ComponentLink1URL: http://www.ck-components.com/media/1479/kmr2.pdf
U200 = CMP-00111-2
U201 = CMP-0440-01132-3: CMOS Hex Non-Inverting Buffer with 3-State Outputs, PW0016A, TUBE; Manufacturer: Texas Instruments; ICC @ Nom Voltage(Max)(mA): 0.06; F @ Nom Voltage(Max)(Mhz): 8; tpd @ Nom Voltage(Max)(ns): 150; Voltage(Nom)(V): 10; VCC(Max)(V): 18; Bits(#): 6; VCC(Min)(V): 3; Rating: Catalog; ComponentLink2Description: Datasheet; Generic Part Number: CD4503B; Input Type: CMOS; DatasheetVersion: SCHS068C; ComponentLink1Description: Manufacturer URL; Code_IPC: MO-153; PackageVersion: http://www.ti.com/lit/ml/mpds361/mpds361.pdf; ComponentLink2URL: http://www.ti.com/lit/ds/symlink/cd4503b.pdf; Operating Temperature Range(C): -55 to 125; Code_JEITA: 1.2; PackageReference: PW0016A; Output Type: CMOS; ComponentLink1URL: http://www.ti.com/; PartNumber: CD4503BPW; Code_JEDEC: MO-153
U202 = CMP-00107-1: IC EEPROM 256KBIT 400KHZ 8UDFN; Manufacturer: ON Semiconductor; Format - Memory: EEPROMs - Serial; Memory Size: 256K (32K x 8); Interface: I²C, 2-Wire Serial; Voltage - Supply: 1.8 V ~ 5.5 V; Packaging: Tape & Reel (TR); Memory Type: EEPROM; Speed: 400kHz; Operating Temperature: -40°C ~ 85°C (TA); Package / Case: 8-UFDFN Exposed Pad; Supplier Device Package: 8-UDFN (2x3); P/N: CAT24C256HU4IGT3; Supplier: Digi-Key; Supplier Part Number: CAT24C256HU4IGT3OSTR-ND; ComponentLink1Description: CAT24C256-D.PDF; ComponentLink1URL: http://www.onsemi.com/pub_link/Collateral/CAT24C256-D.PDF

## Sheet voltage_channel.SchDoc: Voltage Channel
size A4; DrawnBy: Stefan Lippuner; Organization: TIK; DocumentNumber: 6; Revision: 2; SheetNumber: 6; SheetTotal: 8
Used 2 times, as channels Voltage Channels 3 & 4, Voltage Channels 1 & 2. Parts and nets are listed once, with the designators drawn on the sheet.
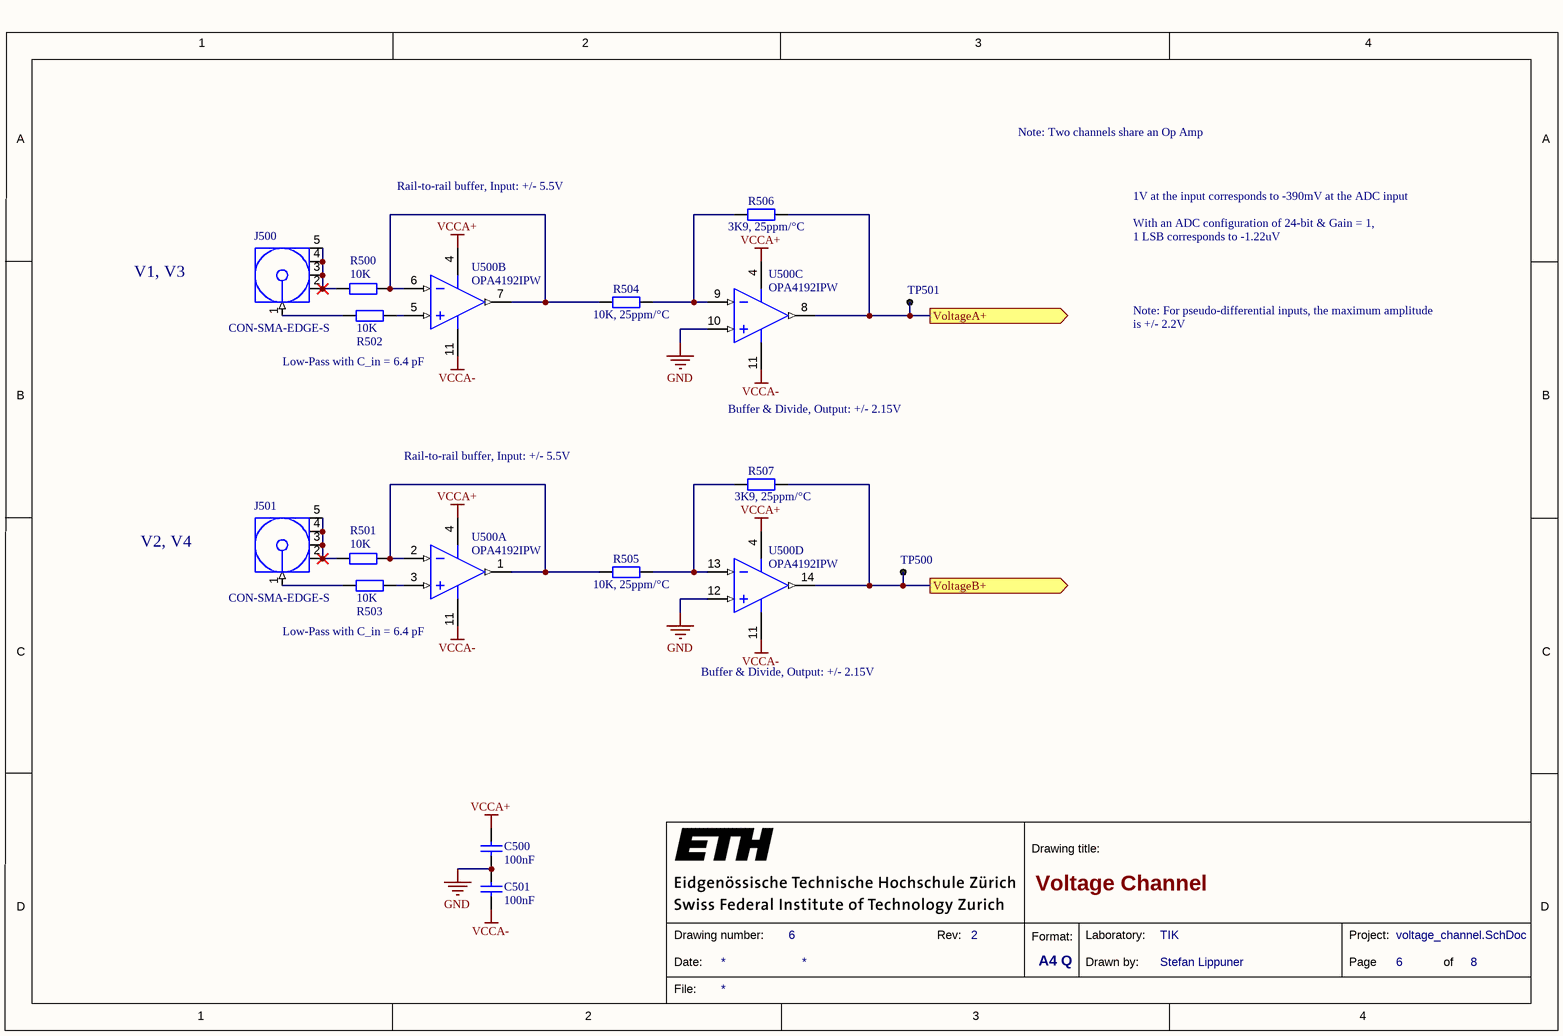
[diagram p5: voltage_channel.SchDoc]

### Parts
(Parts that share a designator on the sheet are numbered #1, #2 ... from top to bottom, then left to right.)
C500  100nF  [CAPC0402(1005)60_L]
C501  100nF  [CAPC0402(1005)60_L]
J500  CON-SMA-EDGE-S  [132322]
J501  CON-SMA-EDGE-S  [132322]
R500  10K  [RESC0402(1005)_L]
R501  10K  [RESC0402(1005)_L]
R502  10K  [RESC0402(1005)_L]
R503  10K  [RESC0402(1005)_L]
R504  10K, 25ppm/°C  [RESC0402(1005)_L]
R505  10K, 25ppm/°C  [RESC0402(1005)_L]
R506  3K9, 25ppm/°C  [RESC0402(1005)_L]
R507  3K9, 25ppm/°C  [RESC0402(1005)_L]
TP500  (no value)  [Pad-0.6mm]  (no BOM)
TP501  (no value)  [Pad-0.6mm]  (no BOM)
U500#1  OPA4192IPW  [TSSOP-ST14_L]  (parts A,B of 4)
U500#2  OPA4192IPW  [TSSOP-ST14_L]  (parts C,D of 4)

### Ports
VoltageA+ (out), VoltageB+ (out)

### Nets
GND: C500.1 C501.2 U500#2.10(VINC+) U500#2.12(VIND+)
VCCA+: C500.2 U500#1.4(VDD) U500#2.4(VDD)
VCCA-: C501.1 U500#1.11(VSS) U500#2.11(VSS)
VoltageA+: R506.2 TP501.1 U500#2.8(VOUTC) ; port VoltageA+
VoltageB+: R507.2 TP500.1 U500#2.14(VOUTD) ; port VoltageB+
NetJ500_1: J500.1(Signal) R502.2
NetJ500_2: J500.2(GND) J500.3(GND) J500.4(GND) J500.5(GND) R500.2
NetJ501_1: J501.1(Signal) R503.2
NetJ501_2: J501.2(GND) J501.3(GND) J501.4(GND) J501.5(GND) R501.2
NetR500_1: R500.1 R504.2 U500#1.6(VINB-) U500#1.7(VOUTB)
NetR501_1: R501.1 R505.2 U500#1.1(VOUTA) U500#1.2(VINA-)
NetR502_1: R502.1 U500#1.5(VINB+)
NetR503_1: R503.1 U500#1.3(VINA+)
NetR504_1: R504.1 R506.1 U500#2.9(VINC-)
NetR505_1: R505.1 R507.1 U500#2.13(VIND-)

### Channels
Voltage Channels 3 & 4: designators C500=C500_1 C501=C501_1 J500=J500_1 J501=J501_1 R500=R500_1 R501=R501_1 R502=R502_1 R503=R503_1 R504=R504_1 R505=R505_1 R506=R506_1 R507=R507_1 TP500=TP500_1 TP501=TP501_1 U500=U500_1#2 U500=U500_1#1; ports VoltageA+=NetR106_2_2 VoltageB+=NetR105_2_2
Voltage Channels 1 & 2: designators C500=C500_2 C501=C501_2 J500=J500_2 J501=J501_2 R500=R500_2 R501=R501_2 R502=R502_2 R503=R503_2 R504=R504_2 R505=R505_2 R506=R506_2 R507=R507_2 TP500=TP500_2 TP501=TP501_2 U500=U500_2#2 U500=U500_2#1; ports VoltageA+=NetR106_1_2 VoltageB+=NetR105_1_2

### Notes on the sheet
- Note: Two channels share an Op Amp
- Rail-to-rail buffer, Input: +/- 5.5V
- 1V at the input corresponds to -390mV at the ADC input
  With an ADC configuration of 24-bit & Gain = 1,
  1 LSB corresponds to -1.22uV
- V1, V3
- Low-Pass with C_in = 6.4 pF
- Note: For pseudo-differential inputs, the maximum amplitude is +/- 2.2V
- Buffer & Divide, Output: +/- 2.15V
- V2, V4
- 1
- 2
- 3
- 4
- A
- B
- C
- Drawing title:
- D
- Date:
- Drawing number:
- Rev:
- Format:
- A4 Q
- Drawn by:
- Laboratory:
- Page
- Project:
- of
- File:

### Library data of the parts
C500 C501 = CMP-1034-02071-1: as C200 on sheet cape; Value: 100nF; Rated Voltage: 16 V; Tolerance: -20% to +80%; Technology: SMT; Max Thickness: 0.6 mm
J500 J501 = CMP-00231-1: SMA FEMALE PCB EDGE MOUNT; Manufacturer: RF Solutions; Connector Type: Jack, Female Socket; Contact Termination: Solder; Packaging: -; Part Status: Active; Connector Style: SMA; Shield Termination: Solder; Impedance: -; Mounting Type: Board Edge, End Launch; Cable Group: -; Fastening Type: Threaded; Frequency - Max: -; Features: -; Housing Color: -; Ingress Protection: -; Body Material: -; Body Finish: -; Center Contact Material: -; Center Contact Plating: -; Dielectric Material: -; Voltage Rating: -; Operating Temperature: -; Manufacturer Part Number: CON-SMA-EDGE-S; Supplier: Digi-Key; Supplier Part Number: CON-SMA-EDGE-S-ND
R500-R503 = CMP-1011-00623-1: as R205 on sheet cape; Tolerance: 1 %; Technology: SMT; Power: 0.063 W
R504 R505 = CMP-1591-00004-1: 10K, 25ppm/°C 0402 (1005 Metric) Chip Resistor; Case-Metric: 1005; Case-EIA: 0402; PackageReference: RESC0402(1005); Supplier 1: Digi-Key; Supplier Part Number 1: RR05P10.0KDDKR-ND
R506 R507 = CMP-1591-00004-1: 3K9, 25ppm/°C, 0402 (1005 Metric) Chip Resistor; Case-EIA: 0402; Case-Metric: 1005; PackageReference: RESC0402(1005); Supplier 1: Digi-Key; Supplier Part Number 1: RR05P3.9KDCT-ND
TP500 TP501 = CMP-00224-2: 0.6mm SMT Test Pad; Mounting Technology: SMT
U500#1 U500#2 = CMP-00106-1: Precision, Rail-to-Rail Input/Output, Low Offset Voltage, Low Input Bias Current Op Amp with e-trim; Manufacturer: Texas Instruments; Amplifier Type: General Purpose; Number of Circuits: 1; Slew Rate: 20 V/µs; Gain Bandwidth Product: 10MHz; Current - Input Bias: 5pA; Voltage - Input Offset: 5µV; Current - Supply: 1mA; Current - Output / Channel: 65mA; Voltage - Supply, Single/Dual (±): 4.5 V ~ 36 V, ±2.25 V ~ 18 V; Packaging: Tube; Output Type: Rail-to-Rail; -3db Bandwidth: -; Operating Temperature: -40°C ~ 125°C; Mounting Type: Surface Mount; Package / Case: 14-TSSOP (0.173", 4.40mm Width); Supplier Device Package: 14-TSSOP; P/N: OPA4192IPW; Supplier: Digi-Key; Supplier Part Number: 296-43691-ND; ComponentLink1Description: opa4192.pdf; ComponentLink1URL: http://www.ti.com/lit/ds/symlink/opa4192.pdf

## Sheet digital_voltage_channel.SchDoc: Digital Voltage Channel
size A4; DrawnBy: Stefan Lippuner; Organization: TIK; DocumentNumber: 7; Revision: 2; SheetNumber: 7; SheetTotal: 8
Used 3 times, as channels Digital Channels 1 & 2, Digital Channels 3 & 4, Digital Channels 5 & 6. Parts and nets are listed once, with the designators drawn on the sheet.
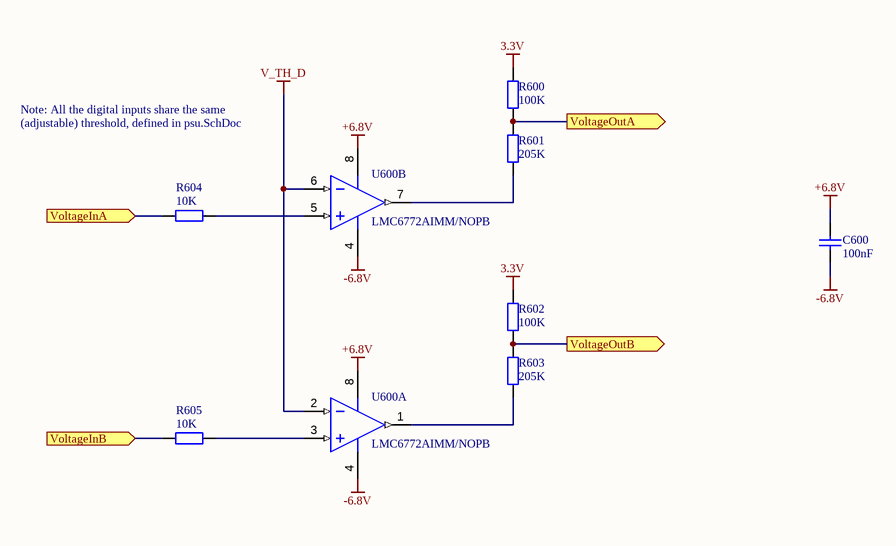
[diagram p6: digital_voltage_channel.SchDoc]

### Parts
(Parts that share a designator on the sheet are numbered #1, #2 ... from top to bottom, then left to right.)
C600  100nF  [CAPC0402(1005)60_L]
R600  100K  [RESC0402(1005)_L]
R601  205K  [RESC0402(1005)_L]
R602  100K  [RESC0402(1005)_L]
R603  205K  [RESC0402(1005)_L]
R604  10K  [RESC0402(1005)_L]
R605  10K  [RESC0402(1005)_L]
U600#1  LMC6772AIMM/NOPB  [DGK0008A_L]  (part B of 2)
U600#2  LMC6772AIMM/NOPB  [DGK0008A_L]  (part A of 2)

### Ports
VoltageInA (in), VoltageInB (in), VoltageOutA (out), VoltageOutB (out)

### Nets
3.3V: R600.2 R602.2
+6.8V: C600.2 U600#1.8(V+) U600#2.8(V+)
-6.8V: C600.1 U600#1.4(V-) U600#2.4(V-)
V_TH_D: U600#1.6(INB-) U600#2.2(INA-)
VoltageInA: R604.2 ; port VoltageInA
VoltageInB: R605.2 ; port VoltageInB
VoltageOutA: R600.1 R601.2 ; port VoltageOutA
VoltageOutB: R602.1 R603.2 ; port VoltageOutB
NetR601_1: R601.1 U600#1.7(OUTB)
NetR603_1: R603.1 U600#2.1(OUTA)
NetR604_1: R604.1 U600#1.5(INB+)
NetR605_1: R605.1 U600#2.3(INA+)

### Channels
Digital Channels 1 & 2: designators C600=C600_1 R600=R600_1 R601=R601_1 R602=R602_1 R603=R603_1 R604=R604_1 R605=R605_1 U600=U600_1#2 U600=U600_1#1; ports VoltageInA=NetJ1_1 VoltageInB=NetJ1_2 VoltageOutA=DigitalInput1 VoltageOutB=DigitalInput2
Digital Channels 3 & 4: designators C600=C600_2 R600=R600_2 R601=R601_2 R602=R602_2 R603=R603_2 R604=R604_2 R605=R605_2 U600=U600_2#2 U600=U600_2#1; ports VoltageInA=NetJ1_3 VoltageInB=NetJ1_4 VoltageOutA=DigitalInput3 VoltageOutB=DigitalInput4
Digital Channels 5 & 6: designators C600=C600_3 R600=R600_3 R601=R601_3 R602=R602_3 R603=R603_3 R604=R604_3 R605=R605_3 U600=U600_3#2 U600=U600_3#1; ports VoltageInA=NetJ1_5 VoltageInB=NetJ1_6 VoltageOutA=DigitalInput5 VoltageOutB=DigitalInput6

### Notes on the sheet
- Note: All the digital inputs share the same (adjustable) threshold, defined in psu.SchDoc
- 1
- 2
- 3
- 4
- A
- B
- C
- Drawing title:
- D
- Date:
- Drawing number:
- Rev:
- Format:
- A4 Q
- Drawn by:
- Laboratory:
- Page
- Project:
- of
- File:

### Library data of the parts
C600 = CMP-1034-02071-1: as C200 on sheet cape; Value: 100nF; Rated Voltage: 16 V; Tolerance: -20% to +80%; Technology: SMT; Max Thickness: 0.6 mm
R600 R602 = CMP-1011-00736-1: as R209 on sheet cape; Tolerance: 1 %; Technology: SMT; Power: 0.063 W
R601 R603 = CMP-1011-00769-1: 205K 0.063W 1% 0402 (1005 Metric)  SMD; Case-EIA: 0402; Value: 205000.00 Ohm; Case-Metric: 1005; Technology: SMT; Tolerance: 1 %; Power: 0.063 W
R604 R605 = CMP-1011-00623-1: as R205 on sheet cape; Tolerance: 1 %; Technology: SMT; Power: 0.063 W
U600#1 U600#2 = CMP-0055-01401-3: Dual Micro-Power Rail-to-Rail Input CMOS Comparator with Open Drain Output, 8-pin Mini SOIC, Pb-Free; Manufacturer: Texas Instruments; PowerWise: Y; CompType: Amplifiers; PackageTopMarking: ZXTT*C21; RoHS: Y; DatasheetVersion: Aug-2000; PackageDescription: MINI SOIC, .118 x .118 x .034in, 8 Lead, .0256in Pitch; Code_JEDEC: MO-187-AA; PackageReference: MUA08A; PackageVersion: revF, Apr-2008; PinCount: 8; PartId: 1; ComponentLink1URL: http://www.ti.com/general/docs/lit/getliterature.tsp?genericPartNumber=LMC6772&fileType=pdf; ComponentLink1Description: Datasheet URL; Package Reference: DGK0008A

## Sheet range_valid_stretching.SchDoc: Range Valid Signal Stretching
size A4; DrawnBy: Stefan Lippuner; Organization: TIK; DocumentNumber: 8; Revision: 2; SheetNumber: 8; SheetTotal: 8
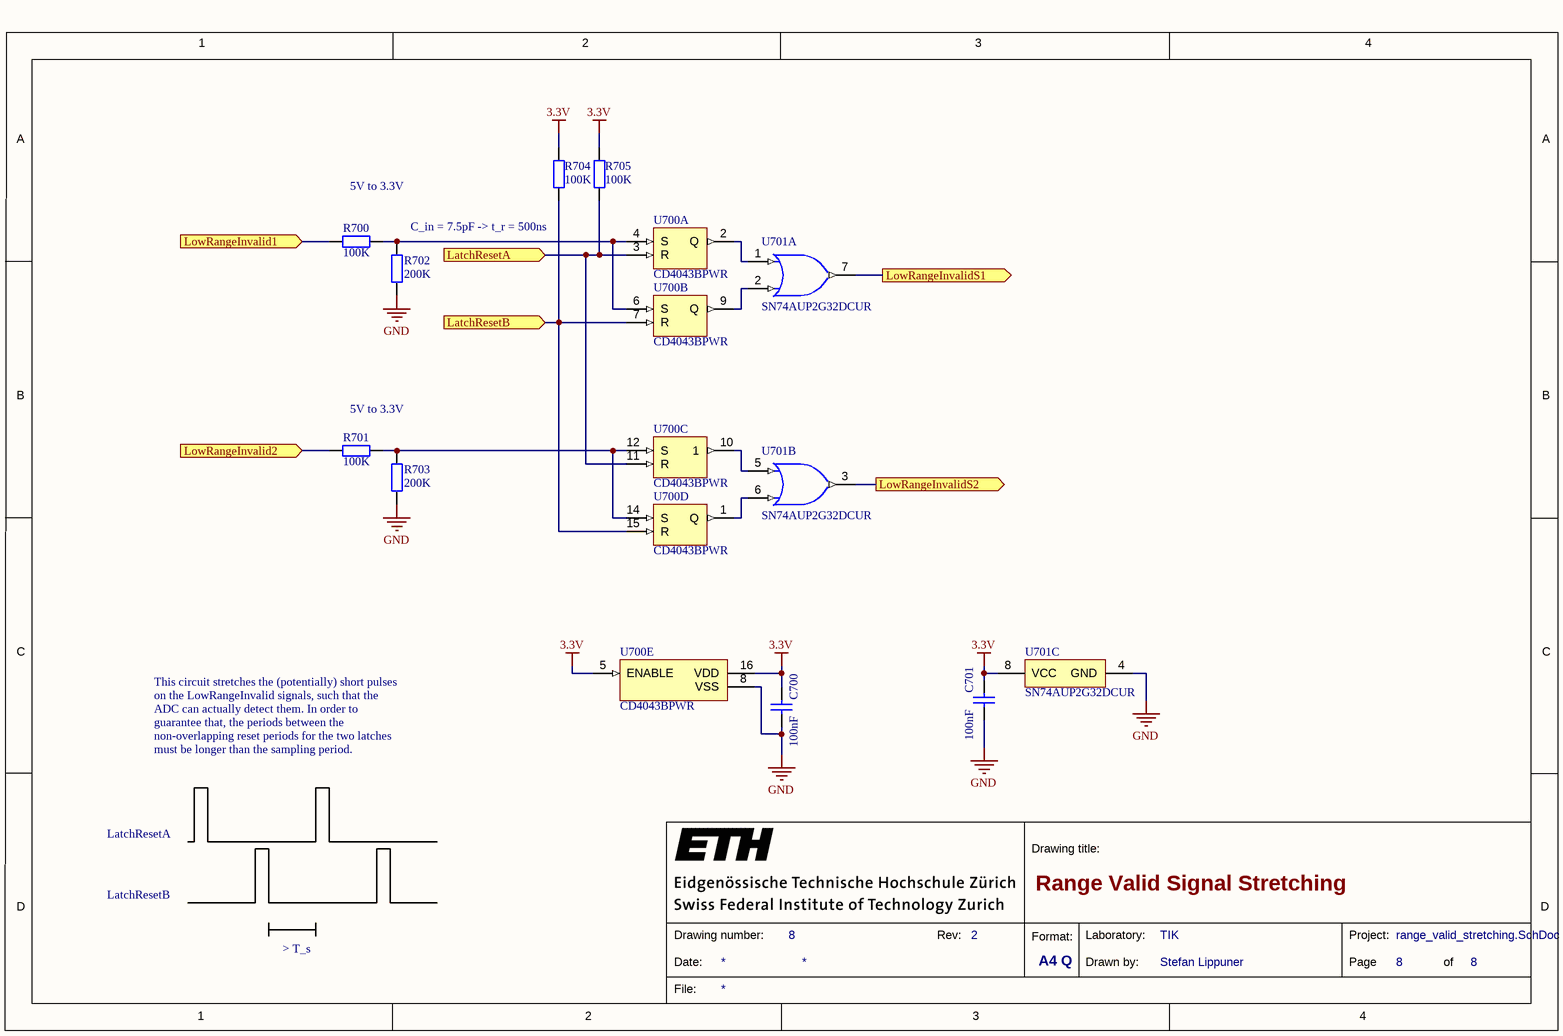
[diagram p7: range_valid_stretching.SchDoc]

### Parts
C700  100nF  [CAPC0402(1005)60_L]
C701  100nF  [CAPC0402(1005)60_L]
R700  100K  [RESC0402(1005)_L]
R701  100K  [RESC0402(1005)_L]
R702  200K  [RESC0402(1005)_L]
R703  200K  [RESC0402(1005)_L]
R704  100K  [RESC0402(1005)_L]
R705  100K  [RESC0402(1005)_L]
U700  CD4043BPWR  [TSSOP-16_L]  (parts A,B,C,D,E of 5)
U701  SN74AUP2G32DCUR  [DCU0008A_L]  (parts A,B,C of 3)

### Ports
LatchResetA (in), LatchResetB (in), LowRangeInvalid1 (in), LowRangeInvalid2 (in), LowRangeInvalidS1 (out), LowRangeInvalidS2 (out)

### Nets
3.3V: C700.2 C701.2 R704.2 R705.2 U700.5(ENABLE) U700.16(VDD) U701.8(VCC)
GND: C700.1 C701.1 R702.1 R703.1 U700.8(VSS) U701.4(GND)
ShortInput: R700.1 ; port LowRangeInvalid1
ShortInput: R701.1 ; port LowRangeInvalid2  [a separate net that carries the same name]
NetR700_2: R700.2 R702.2 U700.4(S) U700.6(S)
NetR701_2: R701.2 R703.2 U700.12(S) U700.14(S)
NetR704_1: R704.1 U700.7(R) U700.15(R) ; port LatchResetB
NetR705_1: R705.1 U700.3(R) U700.11(R) ; port LatchResetA
NetU100_1_42: U701.7(1Y) ; port LowRangeInvalidS1
NetU100_2_42: U701.3(2Y) ; port LowRangeInvalidS2
NetU700_1: U700.1(Q) U701.6(2B)
NetU700_2: U700.2(Q) U701.1(1A)
NetU700_9: U700.9(Q) U701.2(1B)
NetU700_10: U700.10(1) U701.5(2A)

### Notes on the sheet
- 5V to 3.3V
- C_in = 7.5pF -> t_r = 500ns
- This circuit stretches the (potentially) short pulses on the LowRangeInvalid signals, such that the ADC can actually detect them. In order to guarantee that, the periods between the non-overlapping reset periods for the two latches must be longer than the sampling period.
- LatchResetA
- LatchResetB
- > T_s
- 1
- 2
- 3
- 4
- A
- B
- C
- Drawing title:
- D
- Date:
- Drawing number:
- Rev:
- Format:
- A4 Q
- Drawn by:
- Laboratory:
- Page
- Project:
- of
- File:

### Library data of the parts
C700 C701 = CMP-1034-02071-1: as C200 on sheet cape; Value: 100nF; Rated Voltage: 16 V; Tolerance: -20% to +80%; Technology: SMT; Max Thickness: 0.6 mm
R700 R701 R704 R705 = CMP-1011-00736-1: as R203 on sheet cape; Power: 0.063 W; Technology: SMT; Tolerance: 1 %
R702 R703 = CMP-1011-00129-1: 200K 0.063W 5% 0402 (1005 Metric)  SMD; Case-Metric: 1005; Value: 200000.00 Ohm; Case-EIA: 0402; Tolerance: 5 %; Technology: SMT; Power: 0.063 W
U700 = CMP-00223-2: IC NOR R/S LTCH 3ST QUAD 16TSSOP; Manufacturer: Texas Instruments; Logic Type: S-R Latch; Circuit: 1:1; Output Type: Tri-State; Voltage - Supply: 3 V ~ 18 V; Independent Circuits: 4; Delay Time - Propagation: 50ns; Current - Output High, Low: 6.8mA, 6.8mA; Packaging: Tape & Reel (TR); Part Status: Active; Operating Temperature: -55°C ~ 125°C; Mounting Type: Surface Mount; Supplier Device Package: 16-TSSOP; Manufacturer Part Number: CD4043BPWR; Supplier: Digi-Key; Supplier Part Number: 296-14106-2-ND; ComponentLink1Description: cd4043b.pdf; ComponentLink1URL: http://www.ti.com/lit/ds/symlink/cd4043b.pdf; PartId: 1; Package / Case: 16-TSSOP (0.173", 4.40mm Width)
U701 = CMP-0859-00721-3: Low-Power Dual 2-Input Positive-OR Gate, DCU0008A, LARGE T&R; Manufacturer: Texas Instruments; Voltage(Nom)(V): 0.8,1.2,1.5,1.8,2.5,3.3; Output Type: CMOS; Schmitt Trigger: No; ICC @ Nom Voltage(Max)(mA): 0.0009; Technology Family: AUP; Bits(#): 2; Gate Type: OR; VCC(Max)(V): 3.6; Output Drive (IOL/IOH)(Max)(mA): 20/-20; Sub-Family: OR Gate; F @ Nom Voltage(Max)(Mhz): 100; Logic: True; Rating: Catalog; tpd @ Nom Voltage(Max)(ns): 32.8,20.9,14.2,11,7.6,6.2; VCC(Min)(V): 0.8; DatasheetVersion: SCES754B; Operating Temperature Range(C): -40 to 85; Input Type: CMOS; Generic Part Number: SN74AUP2G32; PackageReference: DCU0008A; 3-State Output: No; PartId: 1